# Altium schematic sheet Sheet1.SchDoc: =Title2
size 558 x 431 mm; CompanyName: Magenta City, LLC.; Organization: Magenta City, LLC.; Address4: USA; DocumentNumber: Sheet1.SchDoc; Revision: A0; SecurityClassification: MAGENTA CITY, LLC. SECRET DATA; DecipheredDate: NONE; CompanyPhone: +1-323-375-1152; RnDemail: rnd@magenta.city; CompanyURL: www.magenta.city; Title4: SCHEMATIC DIAGRAM
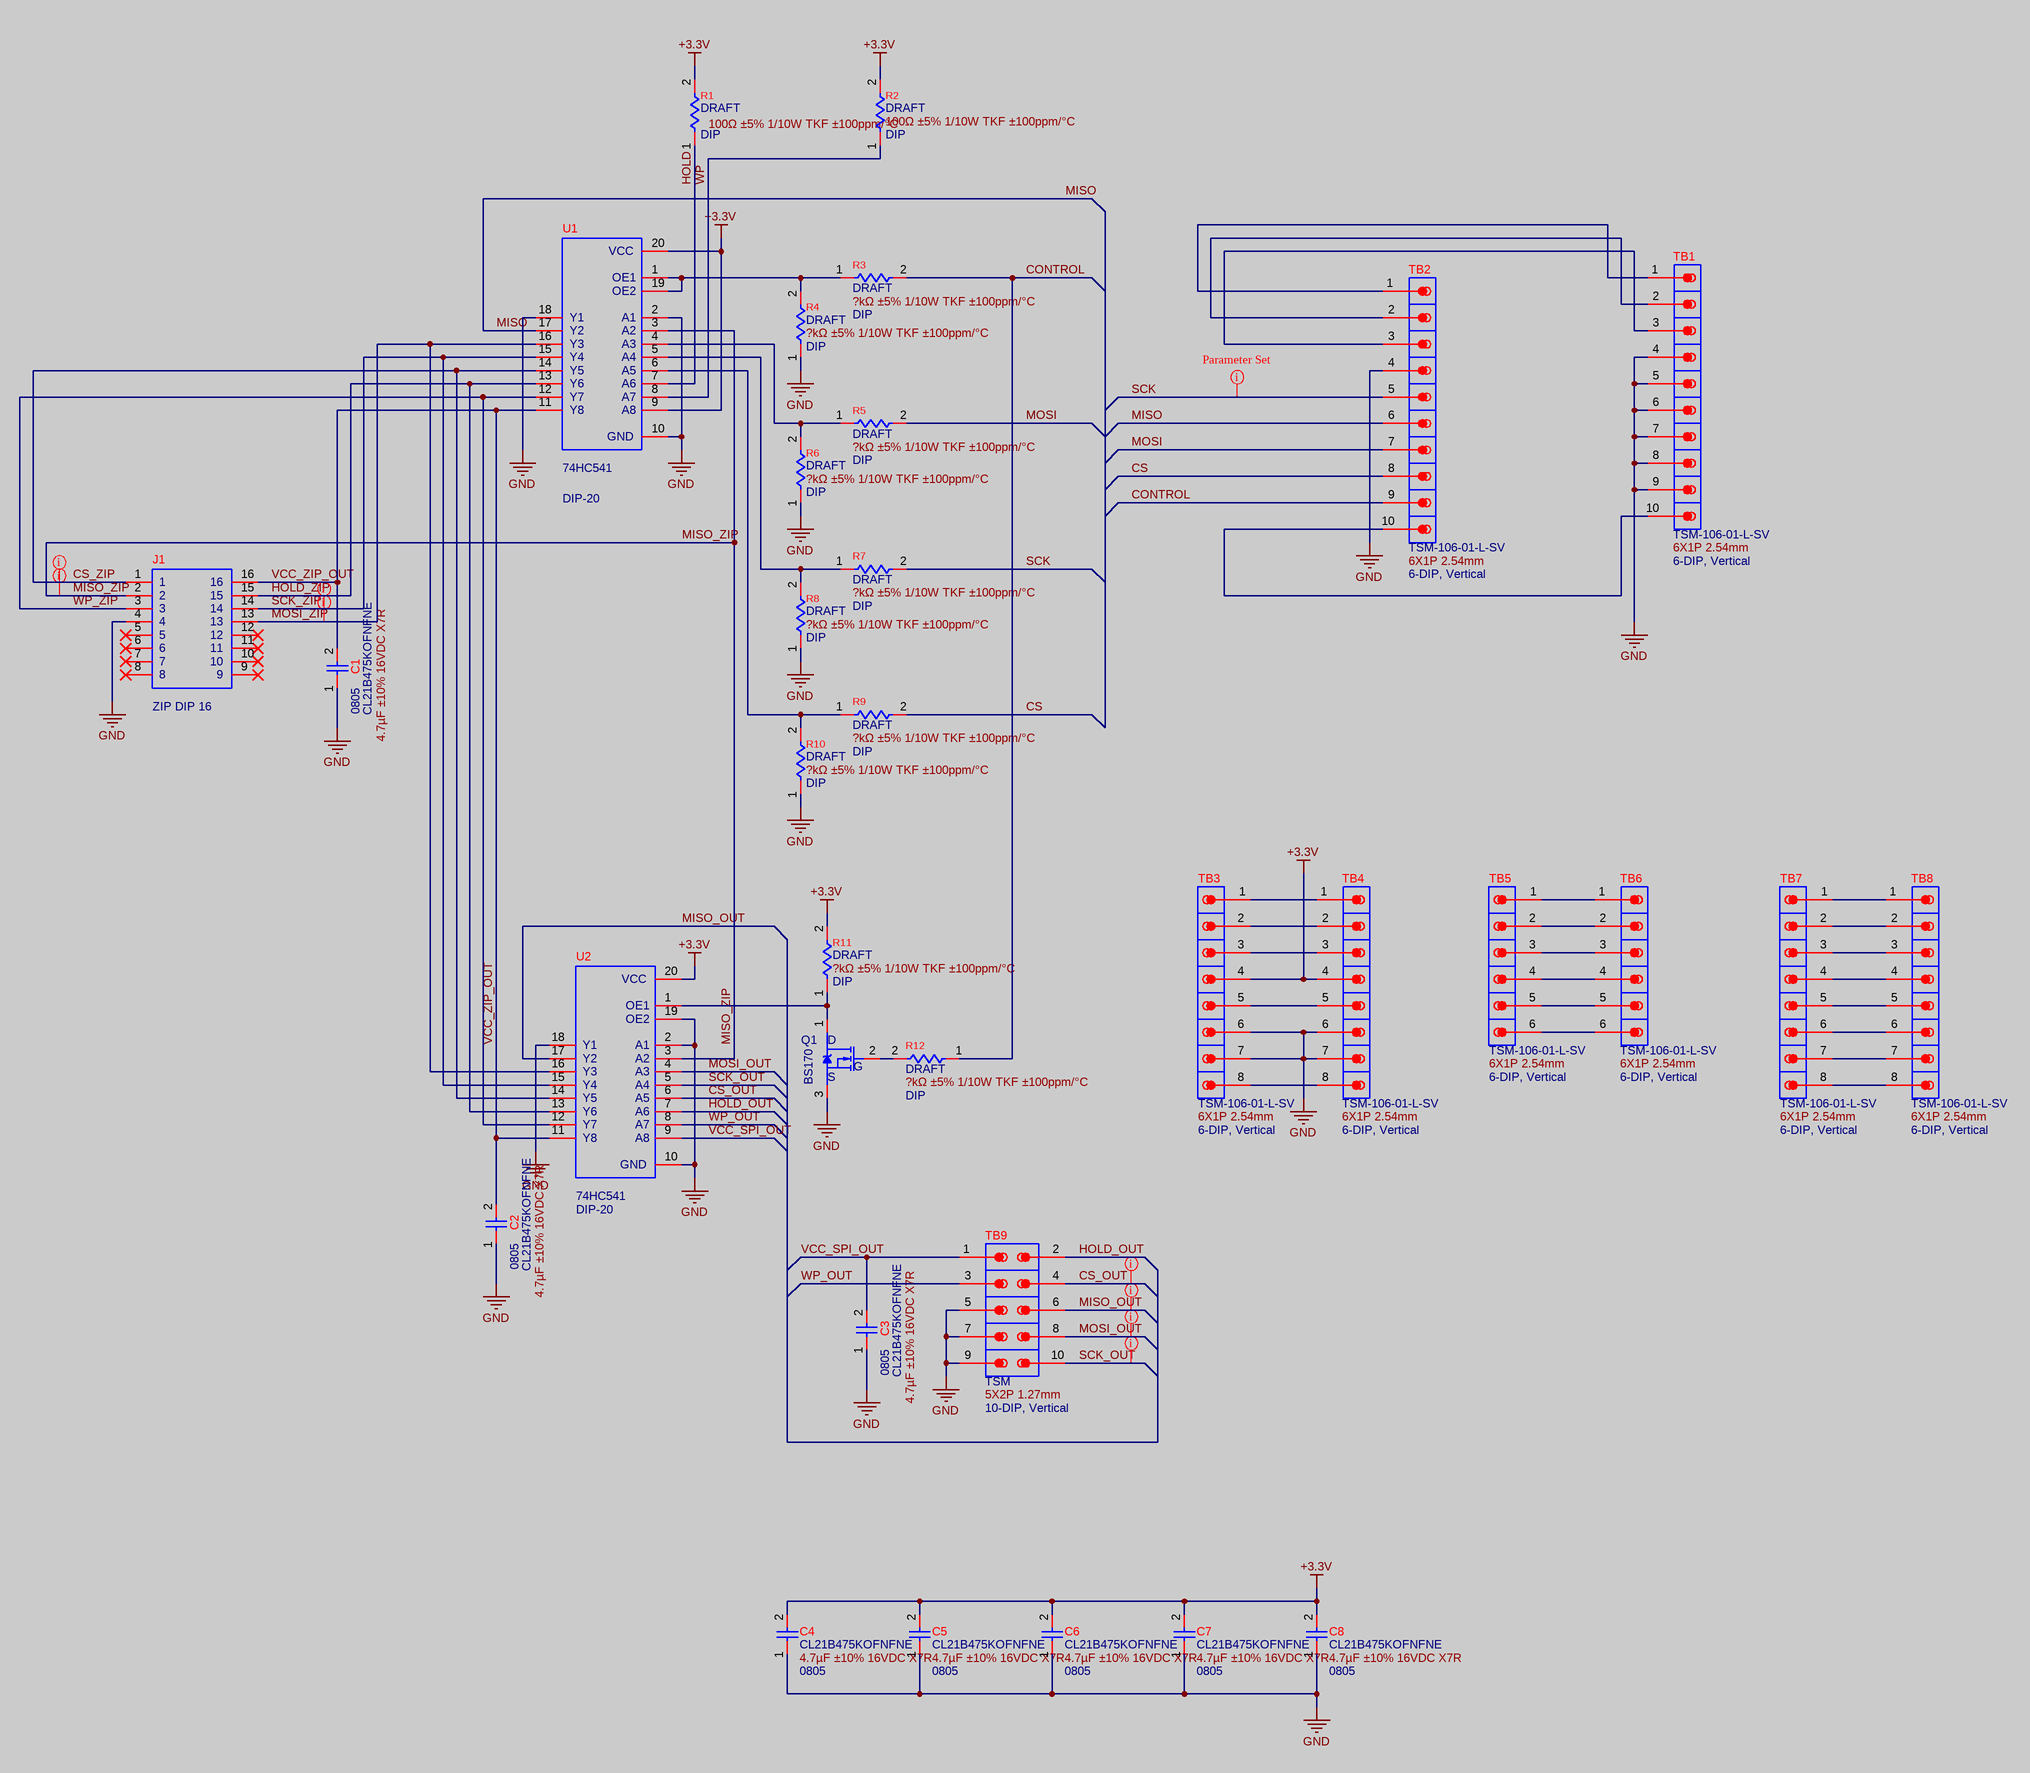
[diagram p0: Sheet1.SchDoc]

## Parts
(Parts that share a designator on the sheet are numbered #1, #2 ... from top to bottom, then left to right.)
?#1  (no value)  (graphical)
?#2  (no value)  (graphical)
C1  CL21B475KOFNFNE  value 4.7µF ±10% 16VDC X7R  Package / Case Code: 0805  [0805_CAP_H1.4mm]
C2  CL21B475KOFNFNE  value 4.7µF ±10% 16VDC X7R  Package / Case Code: 0805  [0805_CAP_H1.4mm]
C3  CL21B475KOFNFNE  value 4.7µF ±10% 16VDC X7R  Package / Case Code: 0805  [0805_CAP_H1.4mm]
C4  CL21B475KOFNFNE  value 4.7µF ±10% 16VDC X7R  Package / Case Code: 0805  [0805_CAP_H1.4mm]
C5  CL21B475KOFNFNE  value 4.7µF ±10% 16VDC X7R  Package / Case Code: 0805  [0805_CAP_H1.4mm]
C6  CL21B475KOFNFNE  value 4.7µF ±10% 16VDC X7R  Package / Case Code: 0805  [0805_CAP_H1.4mm]
C7  CL21B475KOFNFNE  value 4.7µF ±10% 16VDC X7R  Package / Case Code: 0805  [0805_CAP_H1.4mm]
C8  CL21B475KOFNFNE  value 4.7µF ±10% 16VDC X7R  Package / Case Code: 0805  [0805_CAP_H1.4mm]
J1  ZIP DIP 16  [DIP-16]
Q1  BS170  [TO-226-AA]
R1  DRAFT  value 100Ω ±5% 1/10W TKF ±100ppm/°C  Package / Case Code: DIP  [RES-DIP]
R2  DRAFT  value 100Ω ±5% 1/10W TKF ±100ppm/°C  Package / Case Code: DIP  [RES-DIP]
R3  DRAFT  value ?kΩ ±5% 1/10W TKF ±100ppm/°C  Package / Case Code: DIP  [RES-DIP]
R4  DRAFT  value ?kΩ ±5% 1/10W TKF ±100ppm/°C  Package / Case Code: DIP  [RES-DIP]
R5  DRAFT  value ?kΩ ±5% 1/10W TKF ±100ppm/°C  Package / Case Code: DIP  [RES-DIP]
R6  DRAFT  value ?kΩ ±5% 1/10W TKF ±100ppm/°C  Package / Case Code: DIP  [RES-DIP]
R7  DRAFT  value ?kΩ ±5% 1/10W TKF ±100ppm/°C  Package / Case Code: DIP  [RES-DIP]
R8  DRAFT  value ?kΩ ±5% 1/10W TKF ±100ppm/°C  Package / Case Code: DIP  [RES-DIP]
R9  DRAFT  value ?kΩ ±5% 1/10W TKF ±100ppm/°C  Package / Case Code: DIP  [RES-DIP]
R10  DRAFT  value ?kΩ ±5% 1/10W TKF ±100ppm/°C  Package / Case Code: DIP  [RES-DIP]
R11  DRAFT  value ?kΩ ±5% 1/10W TKF ±100ppm/°C  Package / Case Code: DIP  [RES-DIP]
R12  DRAFT  value ?kΩ ±5% 1/10W TKF ±100ppm/°C  Package / Case Code: DIP  [RES-DIP]
TB1  TSM-106-01-L-SV  value 6X1P 2.54mm  Package / Case Code: 6-DIP, Vertical  [SW10]
TB2  TSM-106-01-L-SV  value 6X1P 2.54mm  Package / Case Code: 6-DIP, Vertical  [SW10]
TB3  TSM-106-01-L-SV  value 6X1P 2.54mm  Package / Case Code: 6-DIP, Vertical  [SW8]
TB4  TSM-106-01-L-SV  value 6X1P 2.54mm  Package / Case Code: 6-DIP, Vertical  [SW8]
TB5  TSM-106-01-L-SV  value 6X1P 2.54mm  Package / Case Code: 6-DIP, Vertical  [SW6]
TB6  TSM-106-01-L-SV  value 6X1P 2.54mm  Package / Case Code: 6-DIP, Vertical  [SW6]
TB7  TSM-106-01-L-SV  value 6X1P 2.54mm  Package / Case Code: 6-DIP, Vertical  [SW8]
TB8  TSM-106-01-L-SV  value 6X1P 2.54mm  Package / Case Code: 6-DIP, Vertical  [SW8]
TB9  TSM  value 5X2P 1.27mm  Package / Case Code: 10-DIP, Vertical  [SW10x2_1.27]
U1  74HC541  [CDIP-20]
U2  74HC541  [CDIP-20]

## Nets
+3.3V: C4.2 C5.2 C6.2 C7.2 C8.2 R1.2 R2.2 R11.2 TB3.4 TB4.4 U1.9(A8) U1.20(VCC) U2.20(VCC)
GND: C1.1 C2.1 C3.1 C4.1 C5.1 C6.1 C7.1 C8.1 J1.4 Q1.3(S) R4.1 R6.1 R8.1 R10.1 TB1.4 TB1.5 TB1.6 TB1.7 TB1.8 TB1.9 TB2.4 TB3.6 TB3.7 TB4.6 TB4.7 TB9.5 TB9.7 TB9.9 U1.2(A1) U1.10(GND) U1.18(Y1) U2.2(A1) U2.10(GND) U2.18(Y1) U2.19(OE2)
CONTROL: R3.2 R12.1 TB2.9
CS: R9.2 TB2.8
CS_OUT: TB9.4 U2.6(A5)
CS_ZIP: J1.1 U1.14(Y5) U2.14(Y5)
HOLD: R1.1 U1.7(A6)
HOLD_OUT: TB9.2 U2.7(A6)
HOLD_ZIP: J1.15 U1.13(Y6) U2.13(Y6)
MISO: TB2.6 U1.17(Y2)
MISO_OUT: TB9.6 U2.17(Y2)
MISO_ZIP: J1.2 U1.3(A2) U2.3(A2)
MOSI: R5.2 TB2.7
MOSI_OUT: TB9.8 U2.4(A3)
MOSI_ZIP: J1.13 U1.16(Y3) U2.16(Y3)
SCK: R7.2 TB2.5
SCK_OUT: TB9.10 U2.5(A4)
SCK_ZIP: J1.14 U1.15(Y4) U2.15(Y4)
VCC_SPI_OUT: C3.2 TB9.1 U2.9(A8)
VCC_ZIP_OUT: C1.2 C2.2 J1.16 U1.11(Y8) U2.11(Y8)
WP: R2.1 U1.8(A7)
WP_OUT: TB9.3 U2.8(A7)
WP_ZIP: J1.3 U1.12(Y7) U2.12(Y7)
NetQ1_1: Q1.1(D) R11.1 U2.1(OE1)
NetQ1_2: Q1.2(G) R12.2
NetR3_1: R3.1 R4.2 U1.1(OE1) U1.19(OE2)
NetR5_1: R5.1 R6.2 U1.4(A3)
NetR7_1: R7.1 R8.2 U1.5(A4)
NetR9_1: R9.1 R10.2 U1.6(A5)
NetTB1_1: TB1.1 TB2.1
NetTB1_2: TB1.2 TB2.2
NetTB1_3: TB1.3 TB2.3
NetTB1_10: TB1.10 TB2.10
NetTB3_1: TB3.1 TB4.1
NetTB3_2: TB3.2 TB4.2
NetTB3_3: TB3.3 TB4.3
NetTB3_5: TB3.5 TB4.5
NetTB3_8: TB3.8 TB4.8
NetTB5_1: TB5.1 TB6.1
NetTB5_2: TB5.2 TB6.2
NetTB5_3: TB5.3 TB6.3
NetTB5_4: TB5.4 TB6.4
NetTB5_5: TB5.5 TB6.5
NetTB5_6: TB5.6 TB6.6
NetTB7_1: TB7.1 TB8.1
NetTB7_2: TB7.2 TB8.2
NetTB7_3: TB7.3 TB8.3
NetTB7_4: TB7.4 TB8.4
NetTB7_5: TB7.5 TB8.5
NetTB7_6: TB7.6 TB8.6
NetTB7_7: TB7.7 TB8.7
NetTB7_8: TB7.8 TB8.8

Not connected (* = marked no-connect by the designer): J1 5* 6* 7* 8* 9* 10* 11* 12*

## Layout directives
net class SPI_OUT: CS_OUT, MISO_OUT, MOSI_OUT, SCK_OUT
net class SPI_ZIP: CS_ZIP, MISO_ZIP, MOSI_ZIP, SCK_ZIP

## Notes on the sheet
- REVISION HISTORY
- ZONE
- REV
- DESCRIPTION
- DATE
- APPROVED
- SECURITY CLASSIFICATION:
- APPROVALS
- DATE OF ISSUE:
- DECIPHERED DATE:
- Drawn By
- Engineer
- Date
- Approved By
- Checked By
- TITLE
- Graphic Symbols in accordance with IEEE 315, ANSI/IEEE 315a
- Q.A.
- SIZE
- C
- DWG NO
- THIS SHEET OF ENGINEERING DRAWING IS THE PROPRIETARY PROPERTY OF MAGENTA CITY, LLC. AND CONTAINS CONFIDENTIAL AND TRADE SECRET INFORMATION. THIS SHEET MAY NOT BE TRANSFERRED FROM THE CUSTODY OF THE COMPETENT DIVISION OF R&D DEPARTMENT EXCEPT AS AUTHORIZED BY MAGENTA CITY, LLC. NEITHER THIS SHEET NOR THE INFORMATION IT CONTAINS MAY BE USED BY OR DISCLOSED TO ANY THIRD PARTY WITHOUT PRIOR WRITTEN CONSENT OF MAGENTA CITY, LLC.
- Software: Altium Designer
- SCALE
- NONE
- SHEET
- OF

## Library data of the parts
?#1 = ANSI Revision History Block: ASME Y14.1-2012
?#2 = ANSI City Title Block for A, B, C, and G Sizes: ASME Y14.1-2012
C1-C8 = CL21B475KOFNFNE: CAP CER 0805 / 4.7µF ±10% 25V X7R; Manufacturer: SAMSUNG; Environmental: RoHS Compliant; Mounting Type: SMT; Packaging: Tape&Reel; Thickness (Max): 0.053" (1.35mm); Manufacturer Part Number: CL21B475KOFNFNE; Size / Dimension: 0.079" L x 0.049" W (2.00mm x 1.25mm); Category: CAP CER; Operating Temperature: -55°C to +125°C; ComponentLink5Description: Product Search; ComponentLink5URL: http://www.samsungsem.com/global/support/product-search/index.jsp
J1 = ZIP DIP 16: 3M™ Textool™.100” (2.54 mm) DIP Sockets / ZIP DIP; Manufacturer: TI; Environmental: RoHS Compliant; Category: IC; Packaging: Tray; Base Part Number: ZIP DIP 16; Manufacturer Part Number: ZIP DIP 16; Manufacturer Base Part Number: ZIP DIP 16; ComponentLink1Description: Product Page; ComponentLink1URL: https://www.microchip.com/wwwproducts/en/ATmega328PB; ComponentLink2Description: DataSheet; ComponentLink2URL: http://ww1.microchip.com/downloads/en/DeviceDoc/40001906C.pdf; Mounting Type: DIP; Operating Temperature: -40°C to +105°C
Q1 = BS170: MOSFET N-Channel
R1-R12 = Res DIP: RES DRAFT DIP; Environmental: RoHS Compliant; Package QTY: 5000PCS; Packaging: Tape&Reel Ø7inch (180mm); Category: RES; Manufacturer: DRAFT; Size / Dimension: 0.063" L x 0.032" W (1.60mm x 0.80mm); Height - Seated (Max): ?; ComponentLink1Description: DataSheet; Manufacturer Part Number: DRAFT; Mounting Type: SMT; Operating Temperature: -55°C to +155°C
TB1 TB2 = SW-10: TERMINAL STRIP / 2.54mm 6X1P / SMD Vertical; Manufacturer: Samtec; Environmental: RoHS Compliant; Mounting Type: SMT; Category: TERMINAL STRIP; Manufacturer Part Number: TSM-106-01-L-SV; ComponentLink1Description: Product Page; ComponentLink1URL: https://www.samtec.com/products/tsm-106-01-l-sv; Packaging: Tape&Reel; Package QTY: *
TB3 TB4 TB7 TB8 = SW-8: TERMINAL STRIP / 2.54mm 6X1P / SMD Vertical; Manufacturer: Samtec; Environmental: RoHS Compliant; Mounting Type: SMT; Category: TERMINAL STRIP; Manufacturer Part Number: TSM-106-01-L-SV; ComponentLink1Description: Product Page; ComponentLink1URL: https://www.samtec.com/products/tsm-106-01-l-sv; Packaging: Tape&Reel; Package QTY: *
TB5 TB6 = SW-6: TERMINAL STRIP / 2.54mm 6X1P / SMD Vertical; Manufacturer: Samtec; Environmental: RoHS Compliant; Mounting Type: SMT; Category: TERMINAL STRIP; Manufacturer Part Number: TSM-106-01-L-SV; ComponentLink1Description: Product Page; ComponentLink1URL: https://www.samtec.com/products/tsm-106-01-l-sv; Packaging: Tape&Reel; Package QTY: *
TB9 = TSM-1: TERMINAL STRIP / 1.27mm 5X2P / DIP Vertical; Manufacturer: Samtec; Environmental: RoHS Compliant; Mounting Type: DIP; Category: TERMINAL STRIP; Manufacturer Part Number: TSM; ComponentLink1Description: Product Page; ComponentLink1URL: https://www.samtec.com/products/tsm-105-01-l-dv; Packaging: Tape&Reel; Package QTY: *
U1 U2 = 74HC541: DIP-20; Manufacturer: TI; Environmental: RoHS Compliant; Category: IC; Packaging: Tray; Base Part Number: 74HC541; Manufacturer Part Number: 74HC541; Manufacturer Base Part Number: 74HC541; ComponentLink1Description: Product Page; ComponentLink1URL: https://www.microchip.com/wwwproducts/en/ATmega328PB; ComponentLink2Description: DataSheet; ComponentLink2URL: http://ww1.microchip.com/downloads/en/DeviceDoc/40001906C.pdf; Mounting Type: DIP; Operating Temperature: -40°C to +105°C; Package / Case Code: DIP-20